# Altium schematic sheet 2002_Capteur_Indication.SchDoc
size A3; Author: Joao Marques Chaves; Organization: ETML-ES; Address1: Avenue Recordon 1; Address2: 1004 Lausanne; Address3: Switzerland; SheetNumber: 6; SheetTotal: 7; Version: C
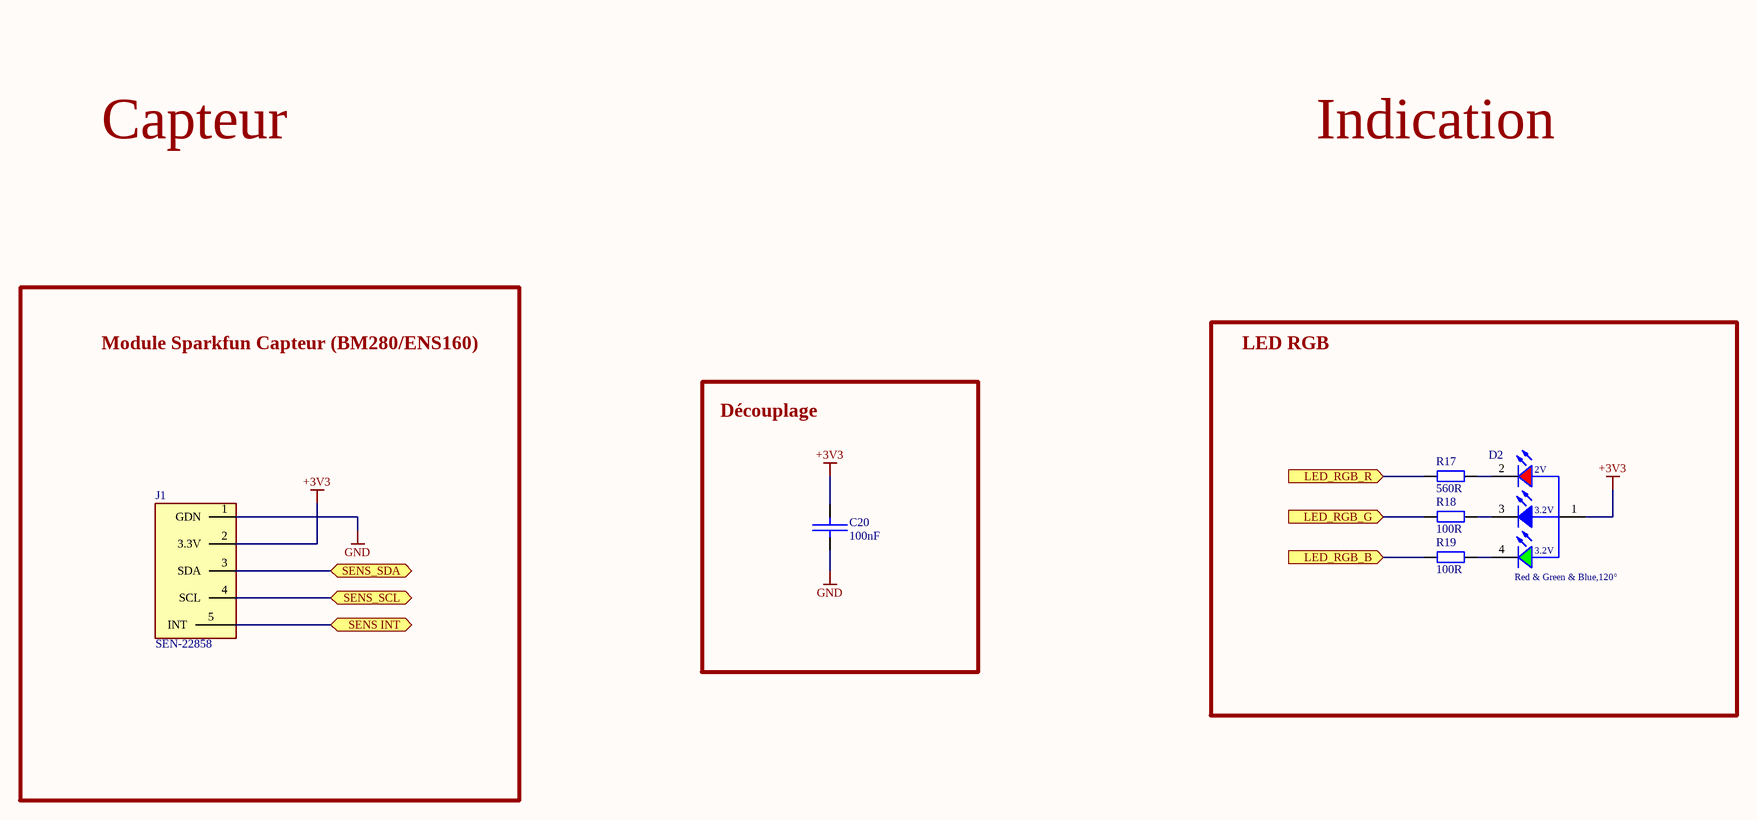
[diagram p0: 2002_Capteur_Indication.SchDoc]

## Parts
C20  100nF  [0805]
D2  Red & Green & Blue,120°  [LED_APHF1608LSEEQBDZGKC]
J1  SEN-22858  [SEN-22858]
R17  560R  [0805]
R18  100R  [0805]
R19  100R  [0805]

## Blocks framed on the sheet
Module Sparkfun Capteur (BM280/ENS160): J1
LED RGB: D2 R17-R19
Découplage: C20

## Ports
LED_RGB_B (in), LED_RGB_G (in), LED_RGB_R (in), SENS INT (bidir), SENS_SCL (bidir), SENS_SDA (bidir)

## Nets
+3V3: C20.1 D2.1 J1.2(3.3V)
GND: C20.2 J1.1(GDN)
LED_RGB_B: R19.1 ; port LED_RGB_B
LED_RGB_G: R18.1 ; port LED_RGB_G
LED_RGB_R: R17.1 ; port LED_RGB_R
SENS INT: J1.5(INT) ; port SENS INT
SENS_SCL: J1.4(SCL) ; port SENS_SCL
SENS_SDA: J1.3(SDA) ; port SENS_SDA
NetD2_2: D2.2(RED) R17.2
NetD2_3: D2.3(BLUE) R18.2
NetD2_4: D2.4(GREEN) R19.2

## Notes on the sheet
- Capteur
- Indication
- Fichier :
- a
- Date :
- Heure :
- Version :
- Auteur :
- Modif.
- b
- c
- d
- Projet :
- No :
- Nb feuilles
- Feuille n°
- Chemin :
- (in symbol APHF1608LSEEQBDZGKC) 2V; 3.2V

## Library data of the parts
C20 = Condensator: Capacitor smd; Value: 100nF
D2 = APHF1608LSEEQBDZGKC: DEL standard - CMS RGB 0603 SMD; Part Number: 150066M153000; Forward Voltage: 3.3 V@Blue, 3.3 V@Green, 2 V@Red; Peak Wavelength: 468 nm@Blue, 520 nm@Green, 632 nm@Red; Dominant Wavelength: 470 nm@Blue, 525 nm@Green, 624 nm@Red; Luminous Intensity: 180 mcd@Blue, 900 mcd@Green, 285 mcd@Red; ComponentLink1Description: Manufacturer; ComponentLink1URL: http://www.we-online.de; ComponentLink2Description: Datasheet; ComponentLink2URL: http://katalog.we-online.de/led/datasheet/150066M153000.pdf; Published Date: May 2018; Publisher: Wurth Elektronik; Size: 0606; Viewing Angle: 120°; Operating Temperature: -40 to 85 degC; Emitting Color: Red & Green & Blue; Mounting Technology: SMT
J1 = BME280/ENS160: Manufacturer_Name: Amphenol; Manufacturer_Part_Number: 68604-804HLF; Datasheet Link: https://componentsearchengine.com/Datasheets/1/68604-804HLF.pdf; Height: 12.39mm; Mouser2 Part Number: 649-68604-804HLF; Mouser2 Price/Stock: https://www.mouser.com/Search/Refine.aspx?Keyword=649-68604-804HLF; ComponentLink1Description: distributeur; ComponentLink1URL: https://www.digikey.ch/en/products/detail/sparkfun-electronics/SEN-22858/21679190?msockid=164a7d802847664138ed69fe294c67a6; ComponentLink2Description: Datasheet; ComponentLink2URL: https://docs.sparkfun.com/SparkFun_Environmental_Combo_Breakout_ENS160_BME280_QWIIC/assets/board_files/SparkFun_ENS160_BME280_Breakout_Schematic_V11.pdf
R17-R19 = RES-0805: SMD Resistor
  R17: Resistance: 560R
  R18 R19: Resistance: 100R